# Altium schematic sheet 电路图.SchDoc
size A4
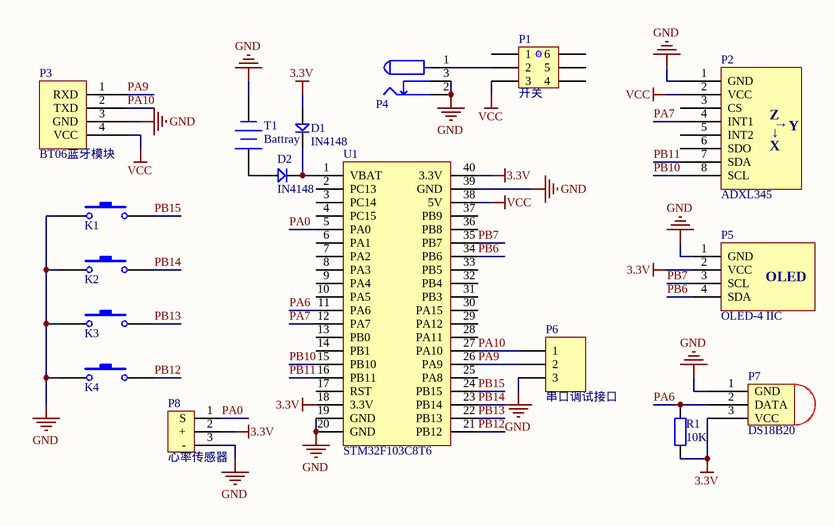
[diagram p0: 电路图.SchDoc]

## Parts
D1  value IN4148  [IN4148]  (hidden comment: Diode)
D2  value IN4148  [IN4148]  (hidden comment: Diode)
K1  KEY  [KEY]  (value not drawn)
K2  KEY  [KEY]  (value not drawn)
K3  KEY  [KEY]  (value not drawn)
K4  KEY  [KEY]  (value not drawn)
P1  开关  [Switch]
P2  ADXL345  [MPU6050]
P3  BT06蓝牙模块  [BT06]
P4  电源插座  [DC 3.5-1.3mm]  (value not drawn)
P5  OLED-4 IIC
P6  串口调试接口  [HDR1X3]
P7  DS18B20  [DS18B20]
P8  心率传感器  [Header3x1]
R1  value 10K  [RES-4]  (hidden comment: RES)
T1  Battray  [Battray-1220]
U1  STM32F103C8T6  [STM32F103C8T6 #MK48]

## Nets
3.3V: D1.1 P5.2(VCC) P7.3(VCC) P8.2(+) R1.1 U1.18(3.3V) U1.40(3.3V)
GND: K1.1 K2.1 K3.1 K4.1 P2.1(GND) P3.3(GND) P4.2 P4.3 P5.1(GND) P6.3 P7.1(GND) P8.3(-) T1.2(-) U1.19(GND) U1.20(GND) U1.39(GND)
VCC: P1.3 P2.2(VCC) P3.4(VCC) U1.38(5V)
PA0: P8.1(S) U1.5(PA0)
PA6: P7.2(DATA) R1.2 U1.11(PA6)
PA7: P2.4(INT1) U1.12(PA7)
PA9: P3.1(RXD) P6.2 U1.26(PA9)
PA10: P3.2(TXD) P6.1 U1.27(PA10)
PB6: P5.4(SDA) U1.34(PB6)
PB7: P5.3(SCL) U1.35(PB7)
PB10: P2.8(SCL) U1.15(PB10)
PB11: P2.7(SDA) U1.16(PB11)
PB12: K4.2 U1.21(PB12)
PB13: K3.2 U1.22(PB13)
PB14: K2.2 U1.23(PB14)
PB15: K1.2 U1.24(PB15)
NetD1_2: D1.2 D2.2 U1.1(VBAT)
NetD2_1: D2.1 T1.1(+)
NetP1_2: P1.2 P4.1

Not connected (* = marked no-connect by the designer): P1 1 4 5 6; P2 3(CS) 5(INT2) 6(SDO); U1 2(PC13) 3(PC14) 4(PC15) 6(PA1) 7(PA2) 8(PA3) 9(PA4) 10(PA5) 13(PB0) 14(PB1) 17(RST) 25(PA8) 28(PA11) 29(PA12) 30(PA15) 31(PB3) 32(PB4) 33(PB5) 36(PB8) 37(PB9)

## Notes on the sheet
- (in symbol ADXL345) Z; →; Y; X
- (in symbol OLED-4 IIC) OLED

## Library data of the parts
P1 = Switch
P2 = ADXL345: 8PIN
P3 = BT06: 4PIN
P4 = POWER: 3PIN
P5 = OLED-4 IIC: 4PIN
P6 = Header 3: Header, 3-Pin; LatestRevisionDate: 17-Jul-2002; LatestRevisionNote: Re-released for DXP Platform.; Publisher: Altium Limited
P8 = Pulse
U1 = STM32F103C8T6  #MK480: 40PIN